# EAGLE design DenScript Tactile Switch V1.0 (EAGLE 9.1.0)
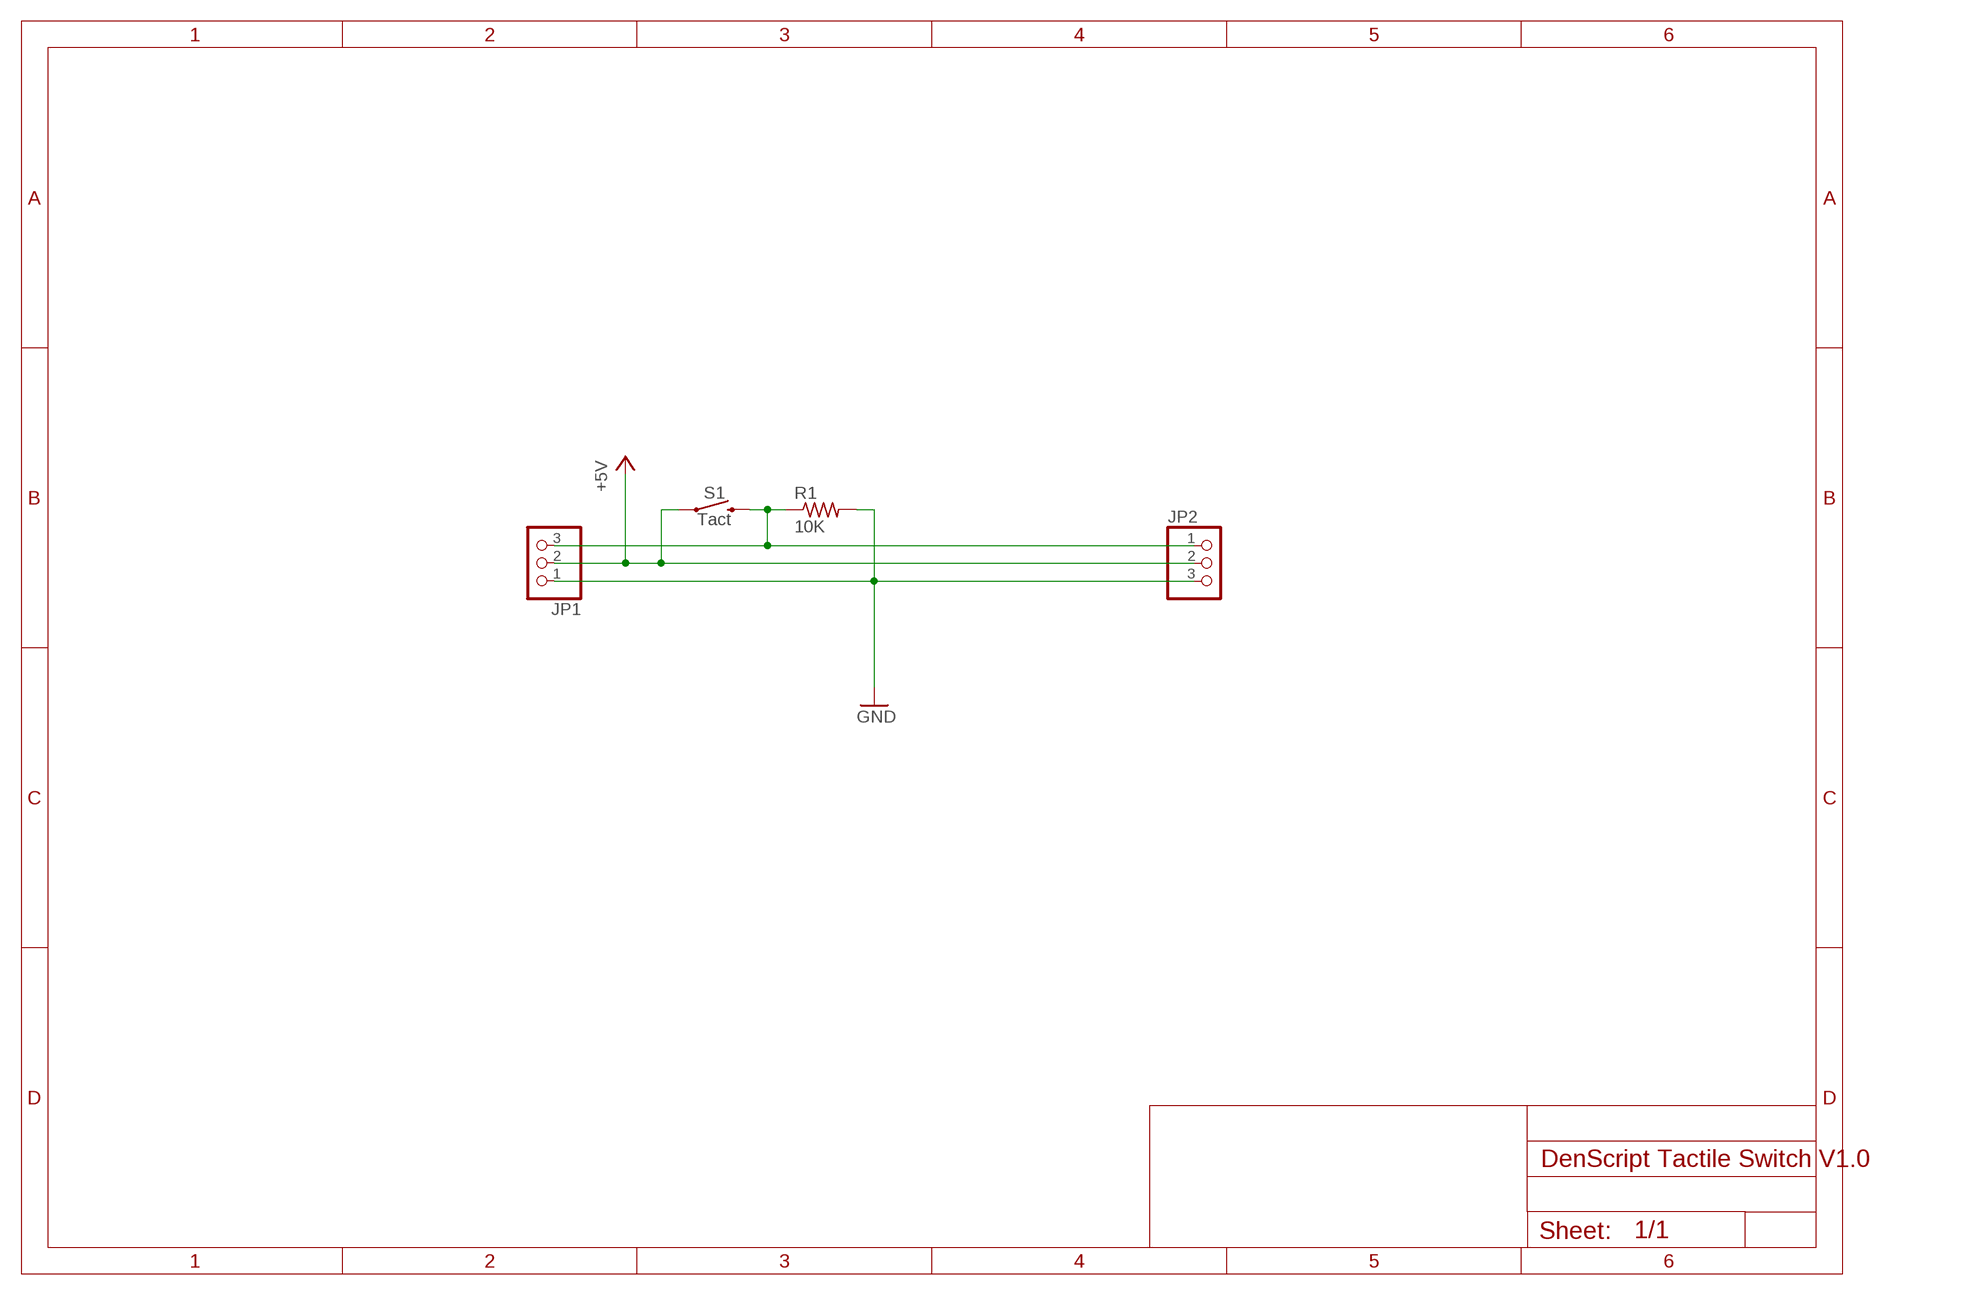
[diagram p0: schematic, sheet 1]

## Parts
JP1  PINHD-1X3  [1X03]
JP2  PINHD-1X3  [1X03]
R1  10K  R-US_R0603  [R0603]
S1  Tact  MOMENTARY-SWITCH-SPST-PTH-6.0MM  [TACTILE_SWITCH_PTH_6.0MM]

## Nets
+5V: JP1.2 JP2.2 S1.1
GND: JP1.1 JP2.3 R1.2
N$1: JP1.3 JP2.1 R1.1 S1.3

## Library data of the parts
JP1 JP2 = adafruit:PINHD-1X3: PIN HEADER
R1 = adafruit:R-US_: RESISTOR, American symbol
S1 = SparkFun-Switches:MOMENTARY-SWITCH-SPST: Momentary Switch (Pushbutton) - SPST Normally-open (NO) SPST momentary switches (buttons, pushbuttons). Variants PTH-12MM - 12mm square, through-hole Momentary Pushbutton Switch - 12mm Square <https://www.sparkfun.com/products/9190> (COM-09190) PTH-6.0MM, PTH-6.0MM-KIT - 6.0mm square, through-hole Mini Pushbutton Switch <https://www.sparkfun.com/products/97> (COM-00097) KIT package intended for soldering kit's - only one side of pads' copper is exposed. PTH-RIGHT-ANGLE-KIT - Right-angle, through-hole Right Angle Tactile Button <https://www.sparkfun.com/products/10791> - Used on SparkFun BigTime Watch Kit <https://www.sparkfun.com/products/11734> SMD-12MM - 12mm square, surface-mount Tactile Button - SMD (12mm) <https://www.sparkfun.com/products/12993> (COM-12993) Used on SparkFun PicoBoard <https://www.sparkfun.com/products/11888> SMD-4.5MM - 4.5mm Square Trackball Switch Used on SparkFun Blackberry Trackballer Breakout <https://www.sparkfun.com/products/13169> SMD-4.6MMX2.8MM - 4.60mm x 2.80mm, surface mount Used on SparkFun SAMD21 Mini Breakout <https://www.sparkfun.com/products/13664> SMD-5.2MM, SMD-5.2-REDUNDANT - 5.2mm square, surface-mount Mini Pushbutton Switch - SMD <https://www.sparkfun.com/products/8720> (COM-08720) Used on Arduino Pro Mini <https://www.sparkfun.com/products/11114> REDUNDANT package connects both switch circuits together SMD-6.0X3.5MM - 6.0 x 3.5mm, surface mount Momentary Reset Switch SMD <https://www.sparkfun.com/products/8229> (COM-08229) SMD-6.2MM-TALL - 6.2mm square, surface mount Tactile Button - SMD (6mm) <https://www.sparkfun.com/products/12992> Used on SparkFun Digital Sandbox <https://www.sparkfun.com/products/12651> SMD-RIGHT-ANGLE - Right-angle, surface mount Used on SparkFun Block for Intel® Edison - Arduino <https://www.sparkfun.com/products/13036>; PROD_ID: SWCH-08441; SF_SKU: COM-00097

## Board
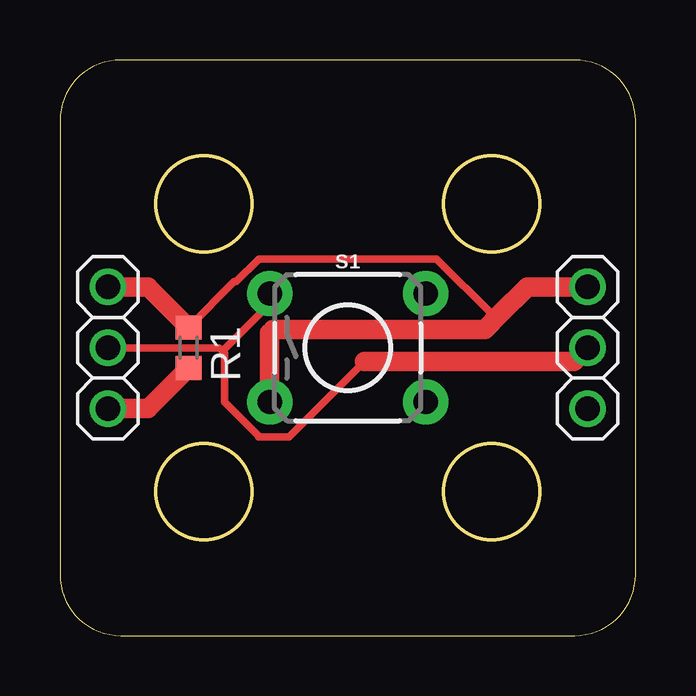
[diagram p1: board, top side]
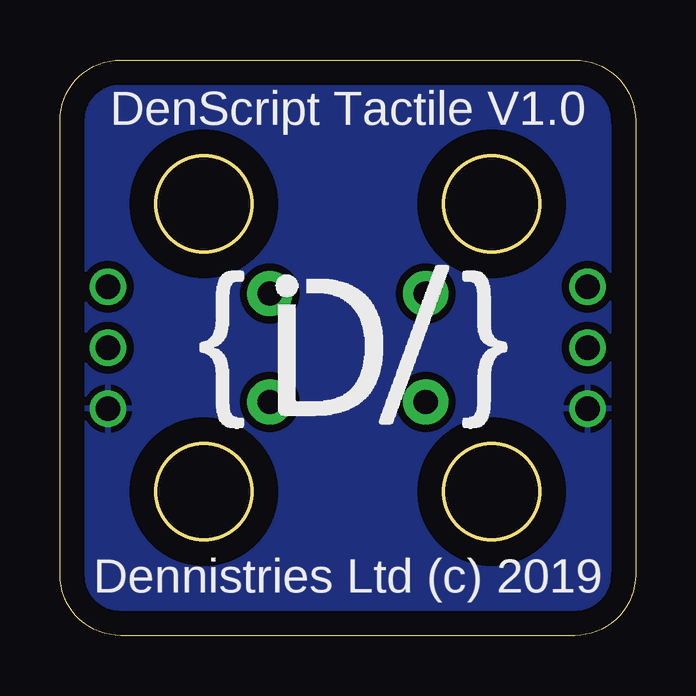
[diagram p2: board, bottom side, seen from below]

Size 24 x 24 mm. Coordinates in mm from the lower left corner, seen from the top.
Outline: 0,21.46 0,2.54 arc90 2.54,0 21.46,0 arc90 24,2.54 24,21.46 arc90 21.46,24 2.54,24 arc90 0,21.46
Outline: circle at 6,18 radius 2
Outline: circle at 6,6 radius 2
Outline: circle at 18,18 radius 2
Outline: circle at 18,6 radius 2
Copper layers (1*16): Top 0.035mm / dielectric 1.5mm / Bottom 0.035mm
Design rules "default": minimum track width 6mil, minimum drill 0.35mm, track to track 6mil, track to pad 6mil, pad to pad 6mil, via to via 6mil, smd to smd 6mil, copper to edge 40mil, drill to drill 6mil, minimum pad ring 10mil, minimum via ring 8mil, stop-mask expansion 4mil, vias tented up to drill 0mil, thermal gap 10mil

### Footprints (pad centres in the part's own frame; a part is rotated, then mirrored left to right if it is on the bottom)
1X03 = drill 1.016: 1 -2.54,0; 2 0,0; 3 2.54,0
R0603 = smd 1 x 1.1: 1 -0.85,0; 2 0.85,0
TACTILE_SWITCH_PTH_6.0MM = drill 1.016 pad 1.88: 1 -3.251,2.261; 2 3.251,2.261; 3 -3.251,-2.261; 4 3.251,-2.261

### Placement (x,y rotation side)
JP1  2,12 90 top
JP2  22,12 270 top
R1  5.37,12 270 top
S1  12,12 0 top

### Tracks (layer width: path | path; a pad name or v marks a point on that pad's centre or on a via)
+5V
  Top 0.254: 8.28,8.28 8.29,8.29
  Top 0.305: 8.28,8.28 9.55,8.28 12.7,11.43 | 8.29,8.29 6.86,9.73 6.86,11.78 6.78,11.86 | 6.78,11.86 6.63,12 JP1.2 | 6.78,11.86 8.75,13.83 S1.1
  Top 0.813: JP2.2 21.43,11.43 12.7,11.43
GND
  Top 0.813: R1.2 3.67,9.46 JP1.1
  pour Bottom (isolate 0.305): 0,0 24.13,0 24.13,24.13 0,24.13
N$1
  Top 0.305: R1.1 7.27,14.76 7.34,14.76 8.29,15.71 15.71,15.71 18.01,13.4 18.35,13.4
  Top 0.813: JP1.3 3.67,14.54 R1.1 | S1.3 8.89,9.88 | 8.75,11.09 S1.3 | 19.49,14.54 JP2.1 | 17.71,12.76 18.35,13.4 | 18.35,13.4 19.49,14.54 | 17.71,12.76 8.89,12.76 8.75,12.62 S1.3 | 17.71,12.76 18.35,13.4 | 18.35,13.4 19.49,14.54

### Text on the board
bPlace: DenScript Tactile V1.0 | Dennistries Ltd (c) 2019